# Altium schematic sheet [11] - POWER.SchDoc: POWER
size A4; Organization: Bjørn T. Brodtkorb; Address1: Frode Rinnans veg 161; Address2: 7050 Trondheim; DocumentNumber: 12; Revision: 1.0; SheetNumber: 12; SheetTotal: 13
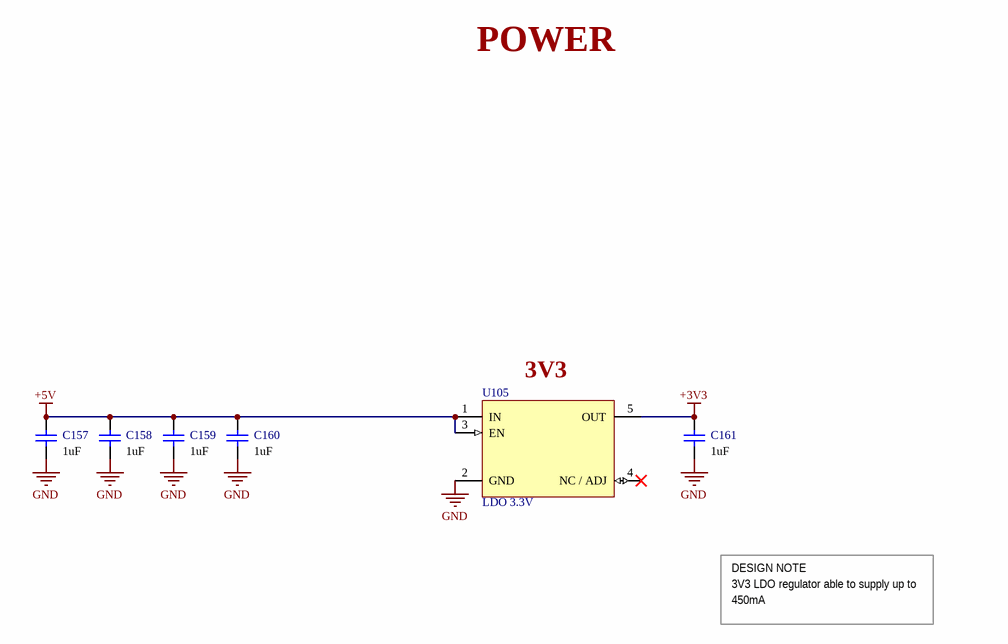
[diagram p0: [11] - POWER.SchDoc]

## Parts
C157  value 1uF  [C0603]  (hidden comment: 02016D104KAT2A)
C158  value 1uF  [C0603]  (hidden comment: 02016D104KAT2A)
C159  value 1uF  [C0603]  (hidden comment: 02016D104KAT2A)
C160  value 1uF  [C0603]  (hidden comment: 02016D104KAT2A)
C161  value 1uF  [C0603]  (hidden comment: 02016D104KAT2A)
U105  LDO 3.3V  [NCV8161BSN330T1G]

## Nets
+3V3: C161.2 U105.5(OUT)
+5V: C157.2 C158.2 C159.2 C160.2 U105.1(IN) U105.3(EN)
GND: C157.1 C158.1 C159.1 C160.1 C161.1 U105.2(GND)

Not connected (* = marked no-connect by the designer): U105 4(NC_/_ADJ)*

## Notes on the sheet
- POWER
- (near U105) 3V3
- DESIGN NOTE
- 3V3 LDO regulator able to supply up to
- 450mA
- Title
- Size:
- Date:
- A4
- Number:
- Time:
- Revision:
- Sheet
- of
- StrawberryHacker
- File:

## Library data of the parts
C157-C161 = 02016D104KAT2A: C0603
U105 = NCV8161BSN330T1G: LDO fixed 3.3V 450mA ultra-low noise; RMS noise: < 100 uVrms; Dropout voltage: 330mV; Supplier Part Number 1: 2775470; Supplier 1: Farnell; Output voltage: 3.3V; Output current: 450mA